# EAGLE schematic All Modules (EAGLE 9.5.1)
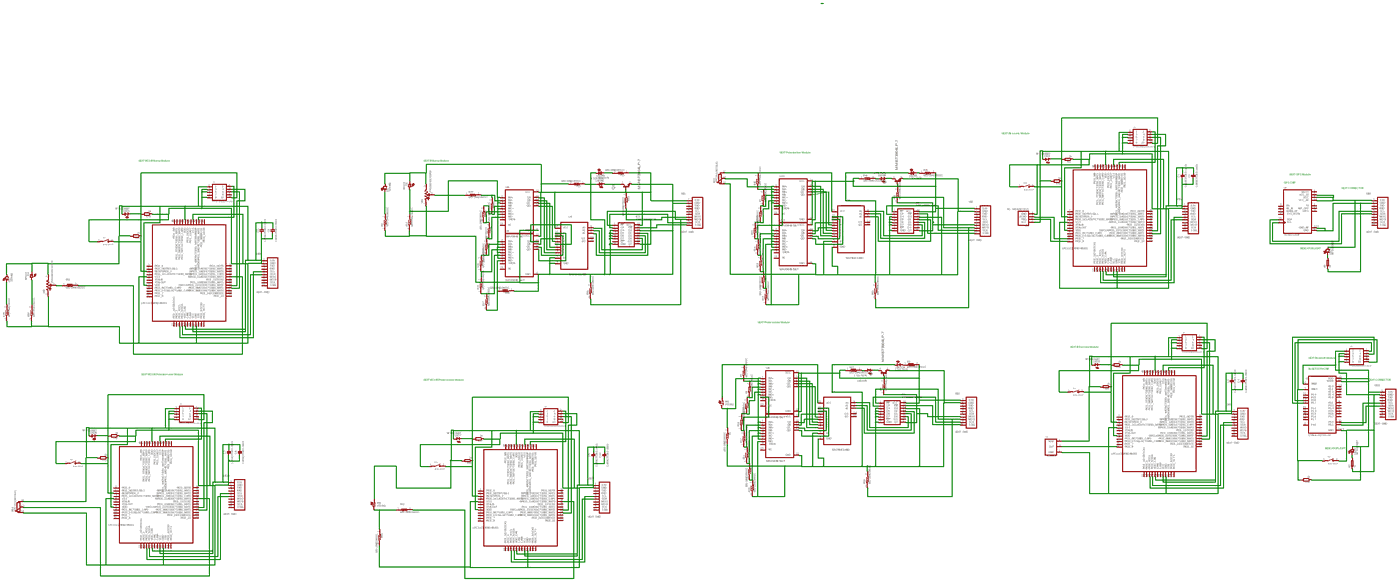
[diagram p0: schematic, sheet 1, overview]
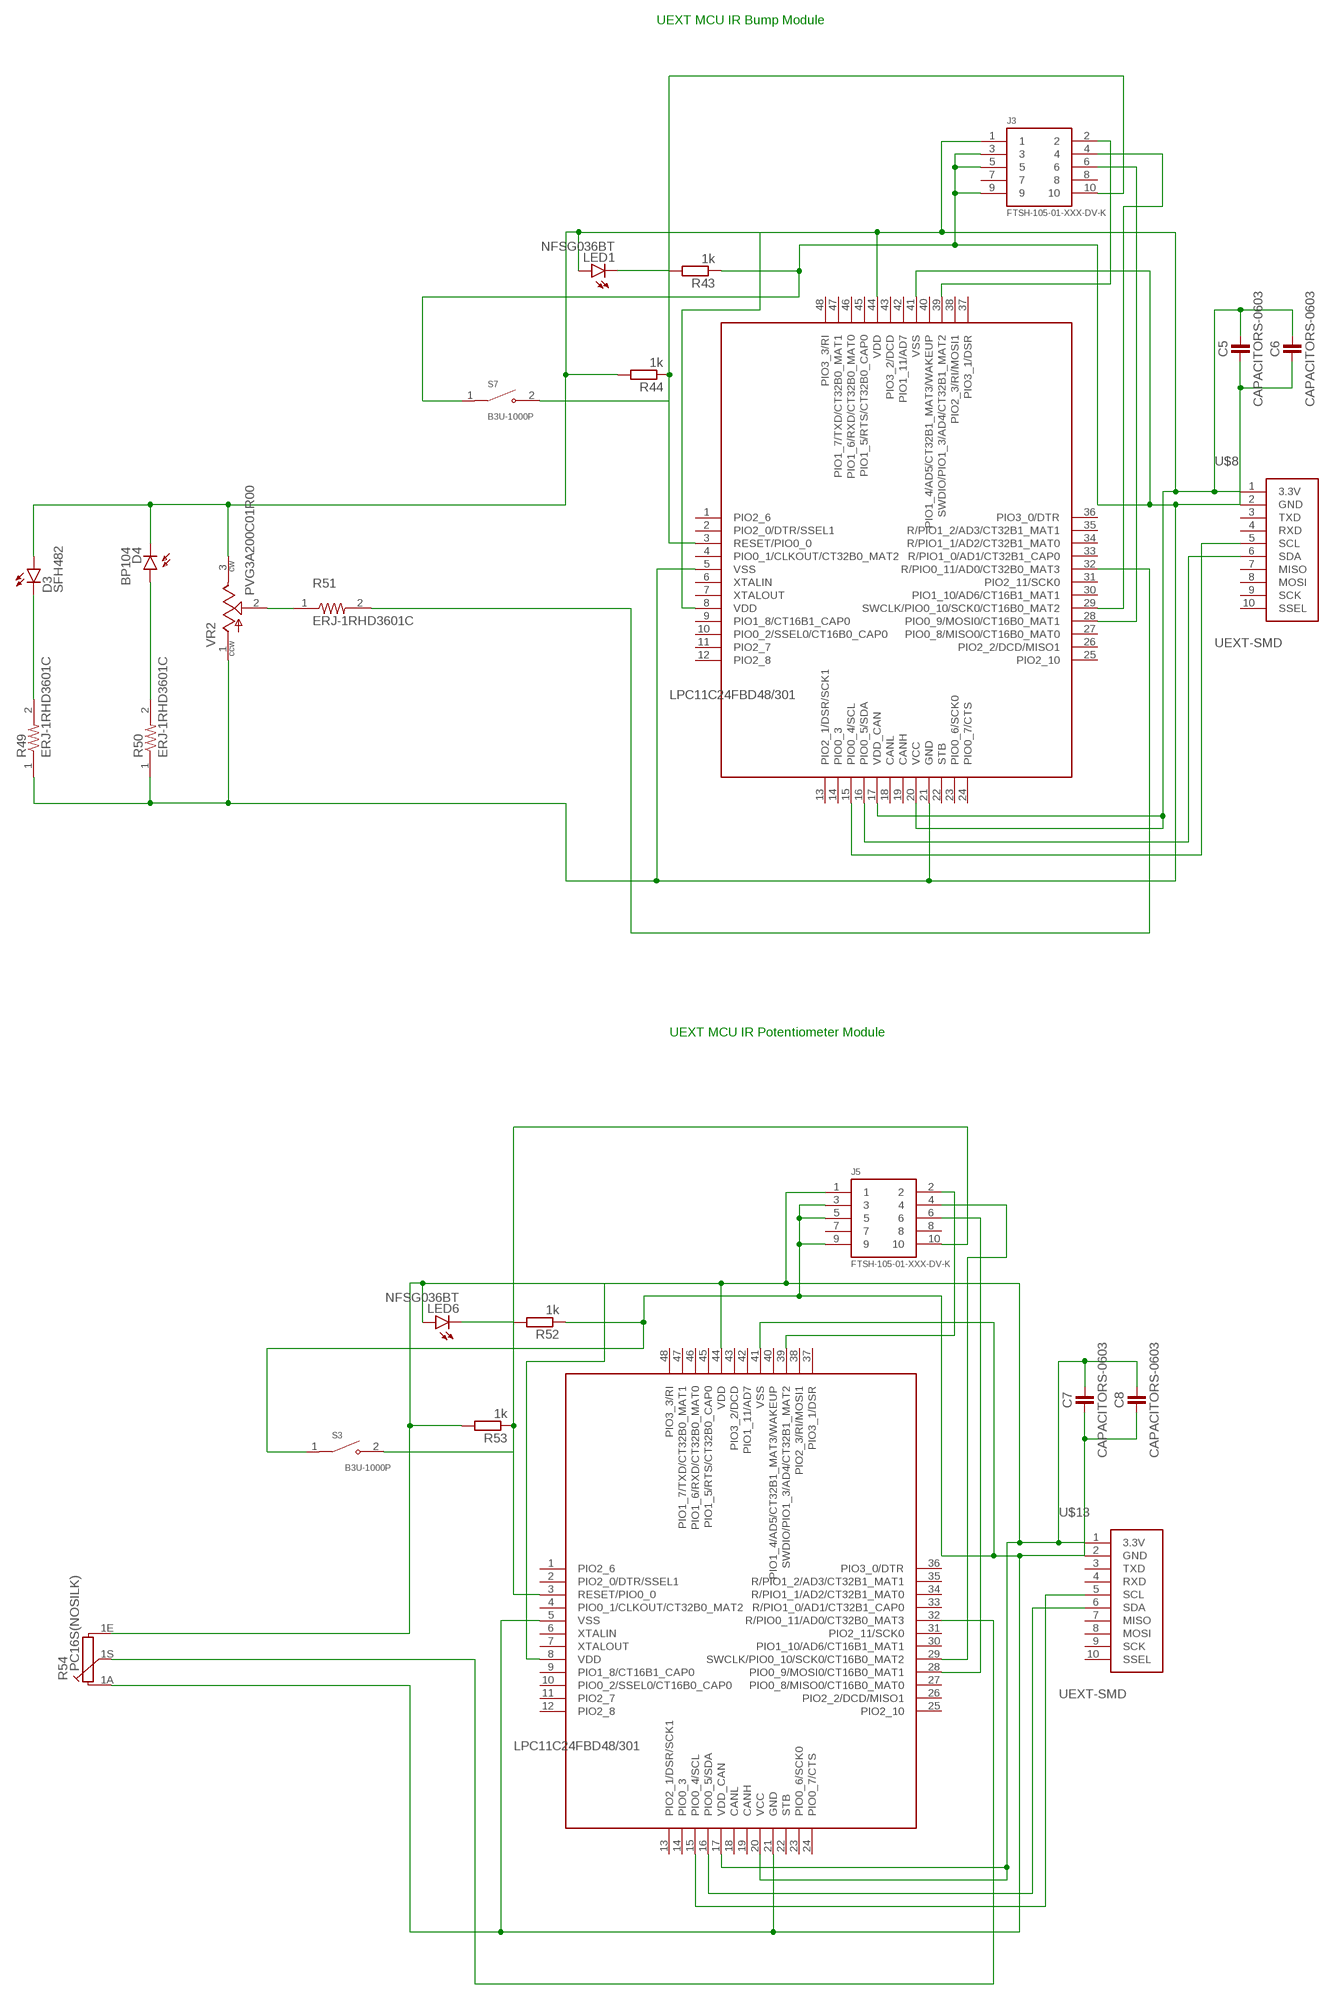
[diagram p1: schematic, sheet 1, part 1 of 4]
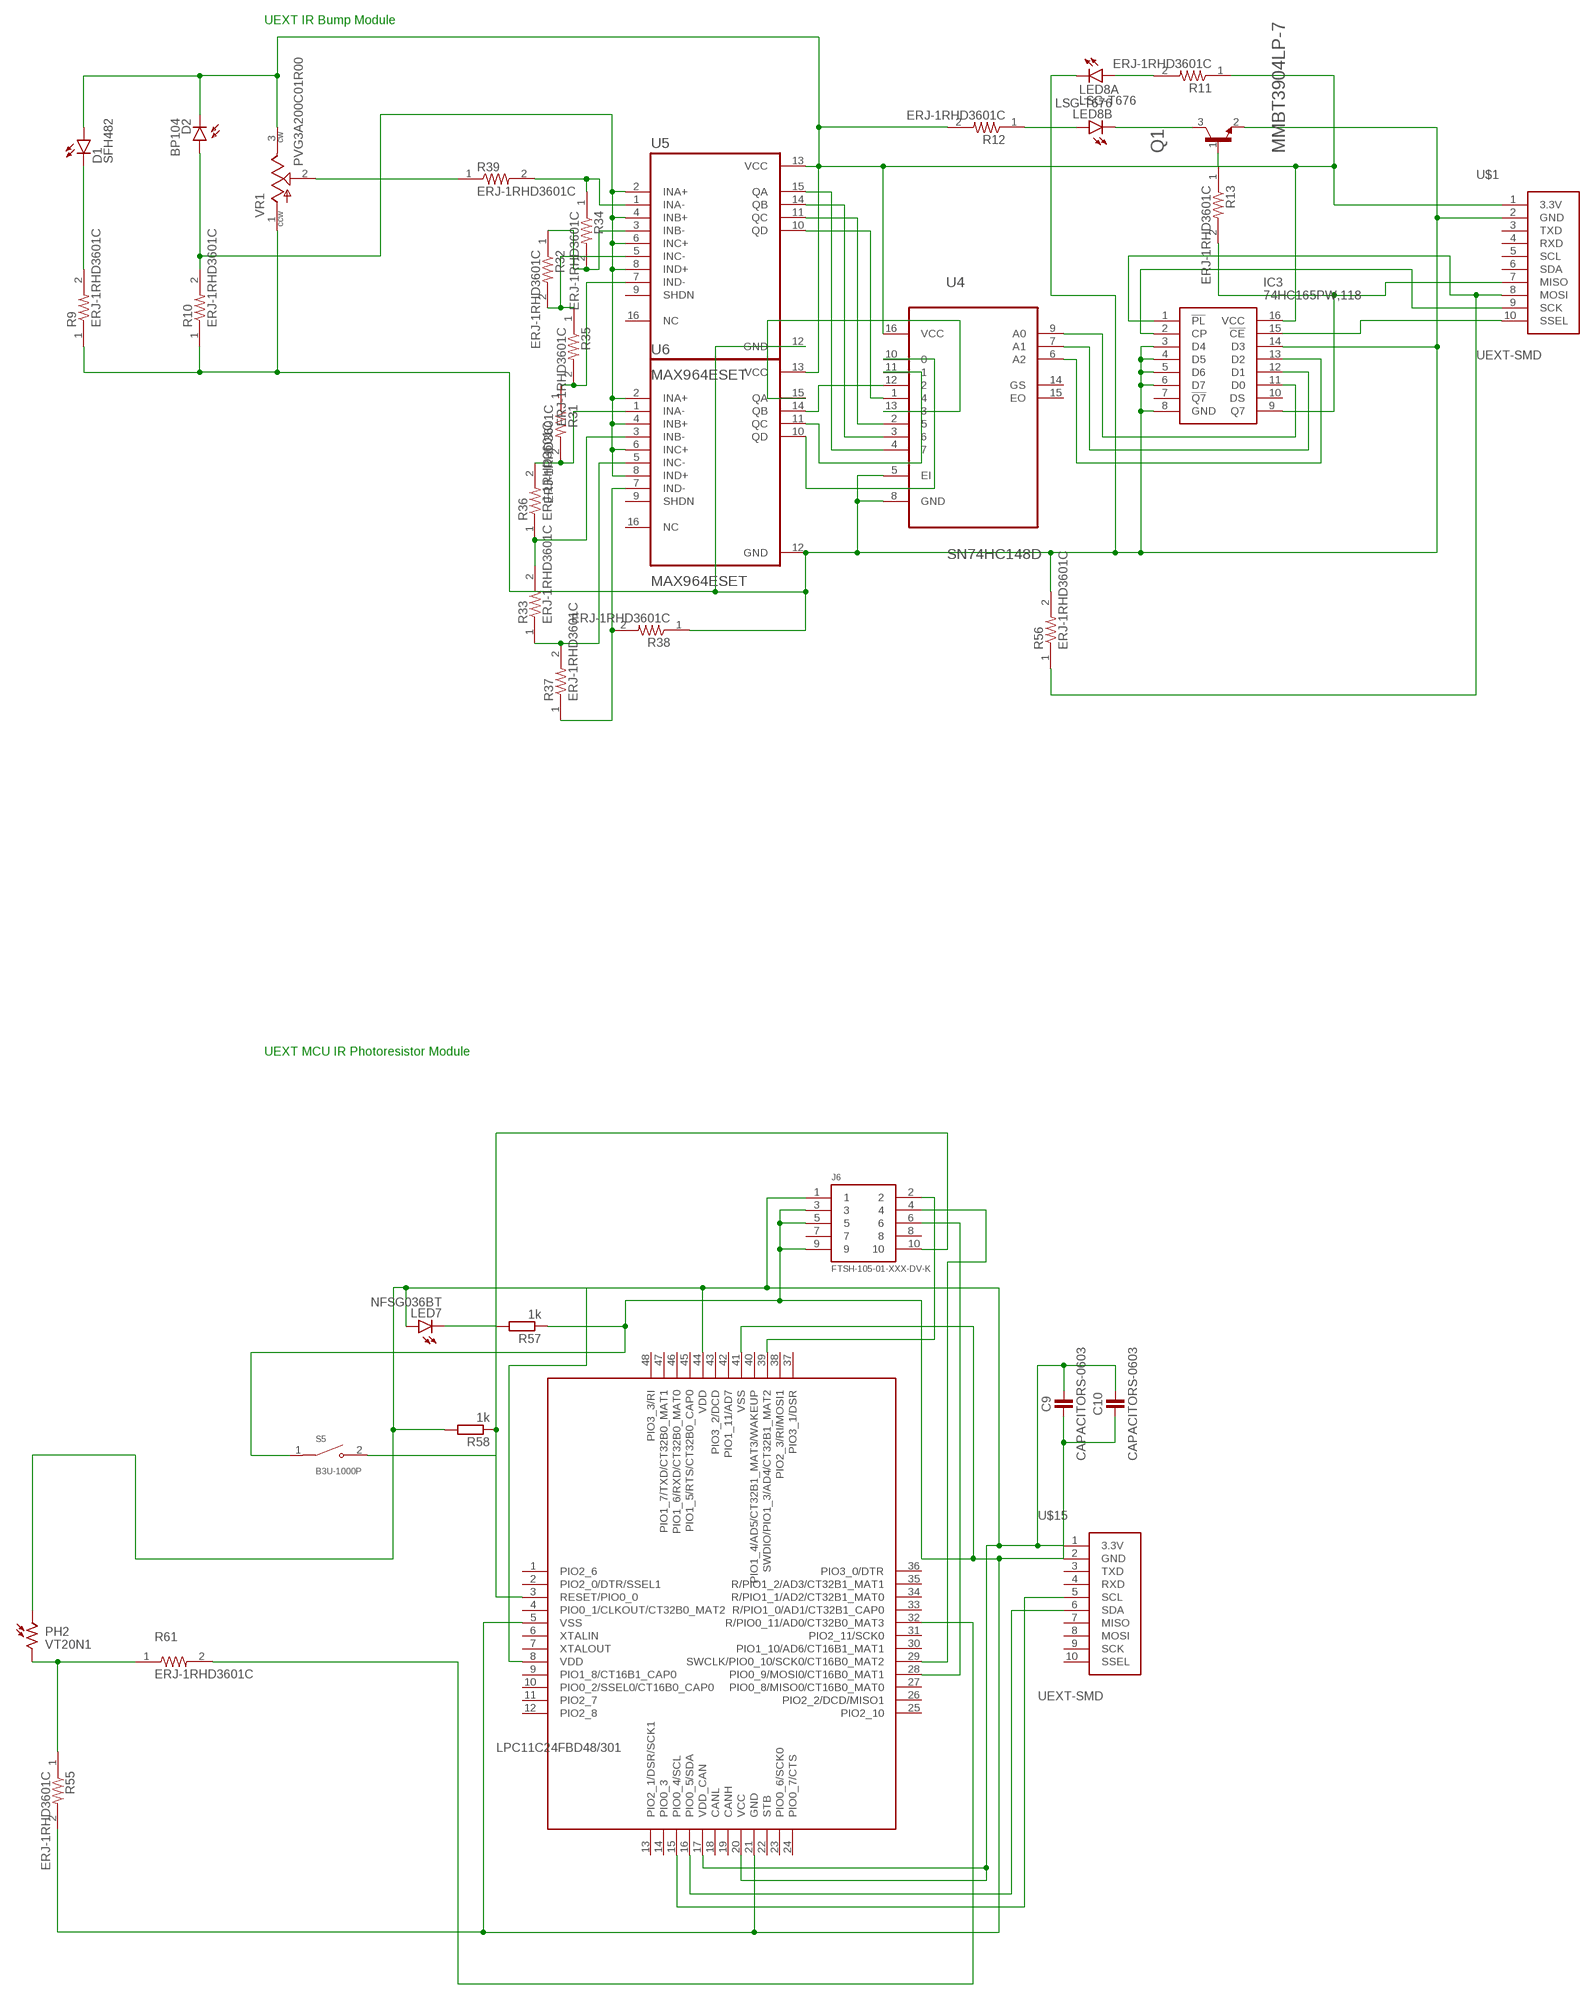
[diagram p2: schematic, sheet 1, part 2 of 4]
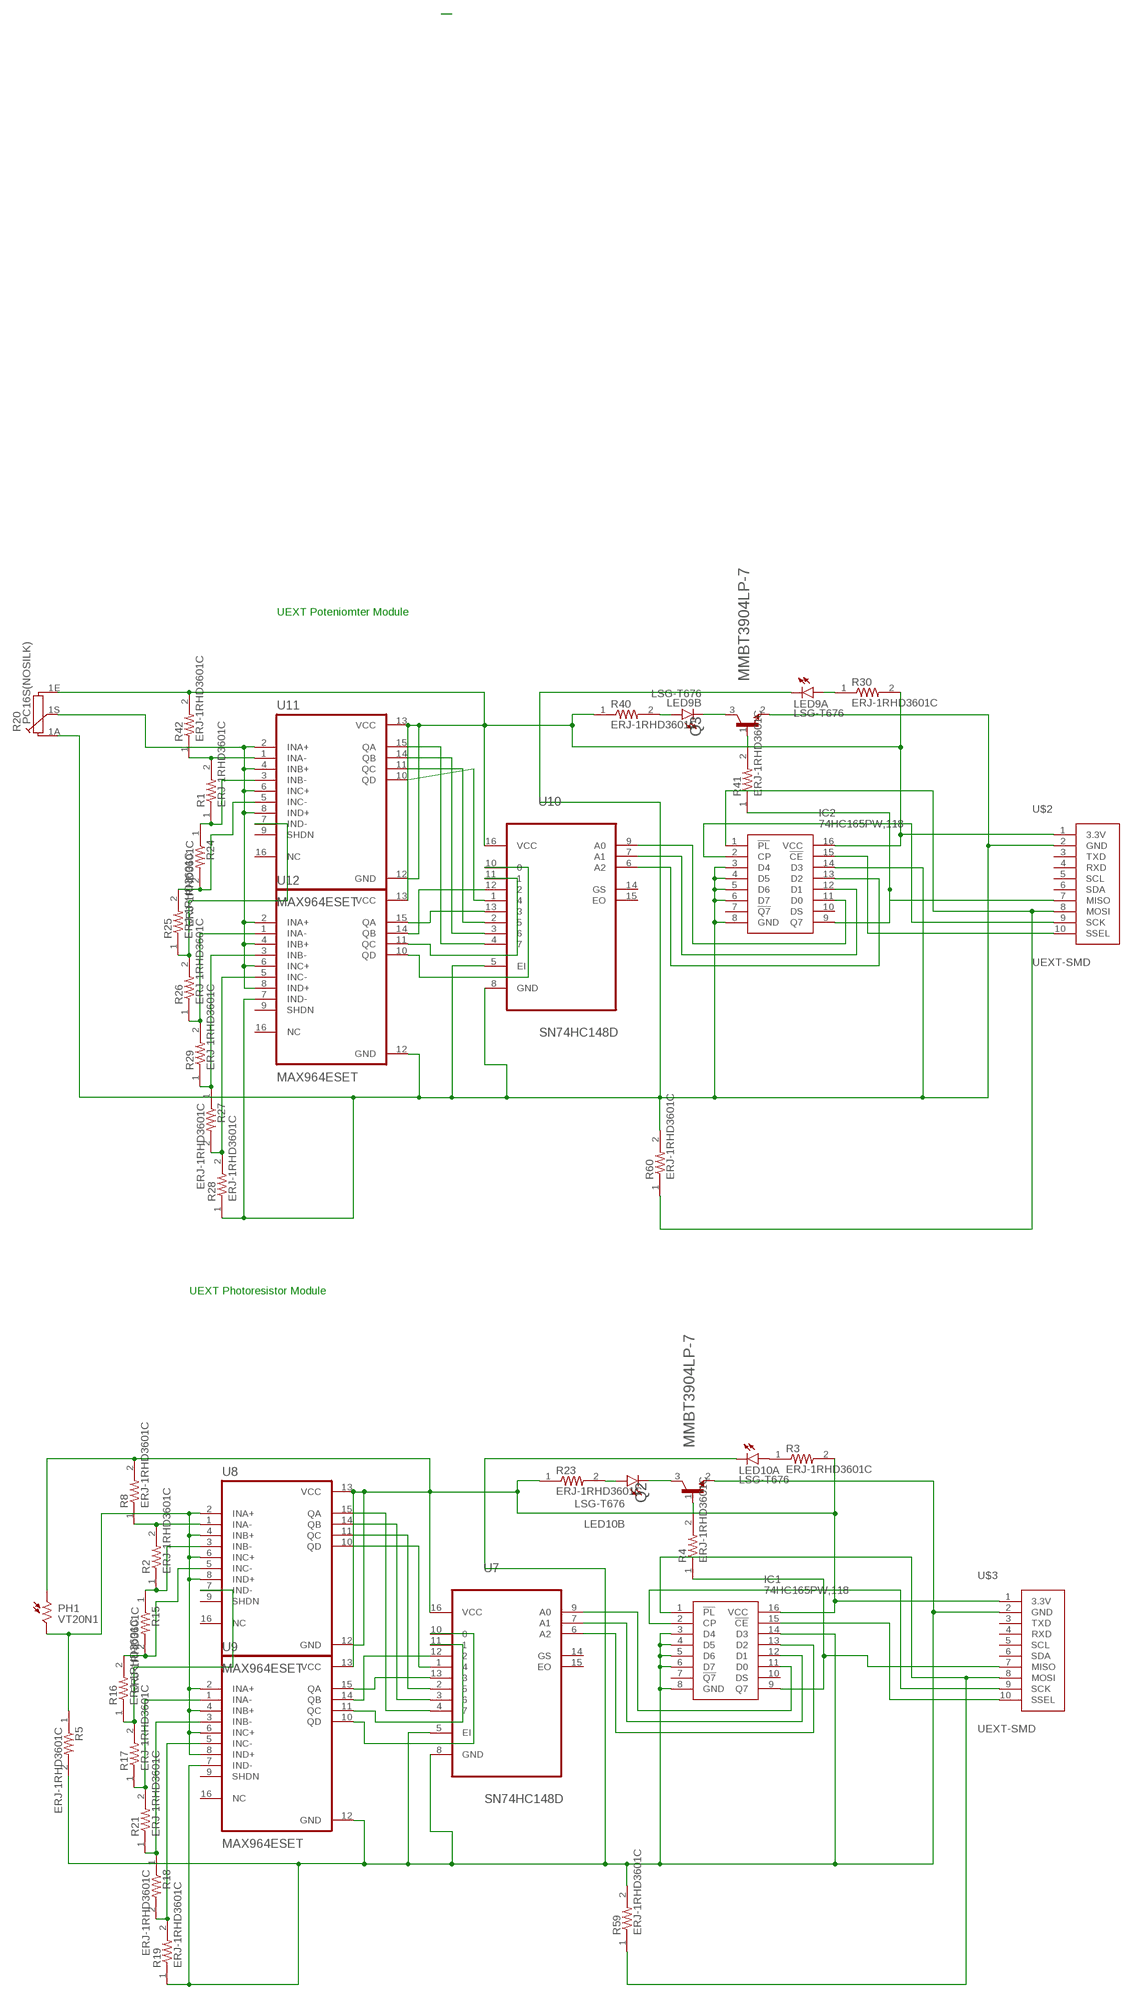
[diagram p3: schematic, sheet 1, part 3 of 4]
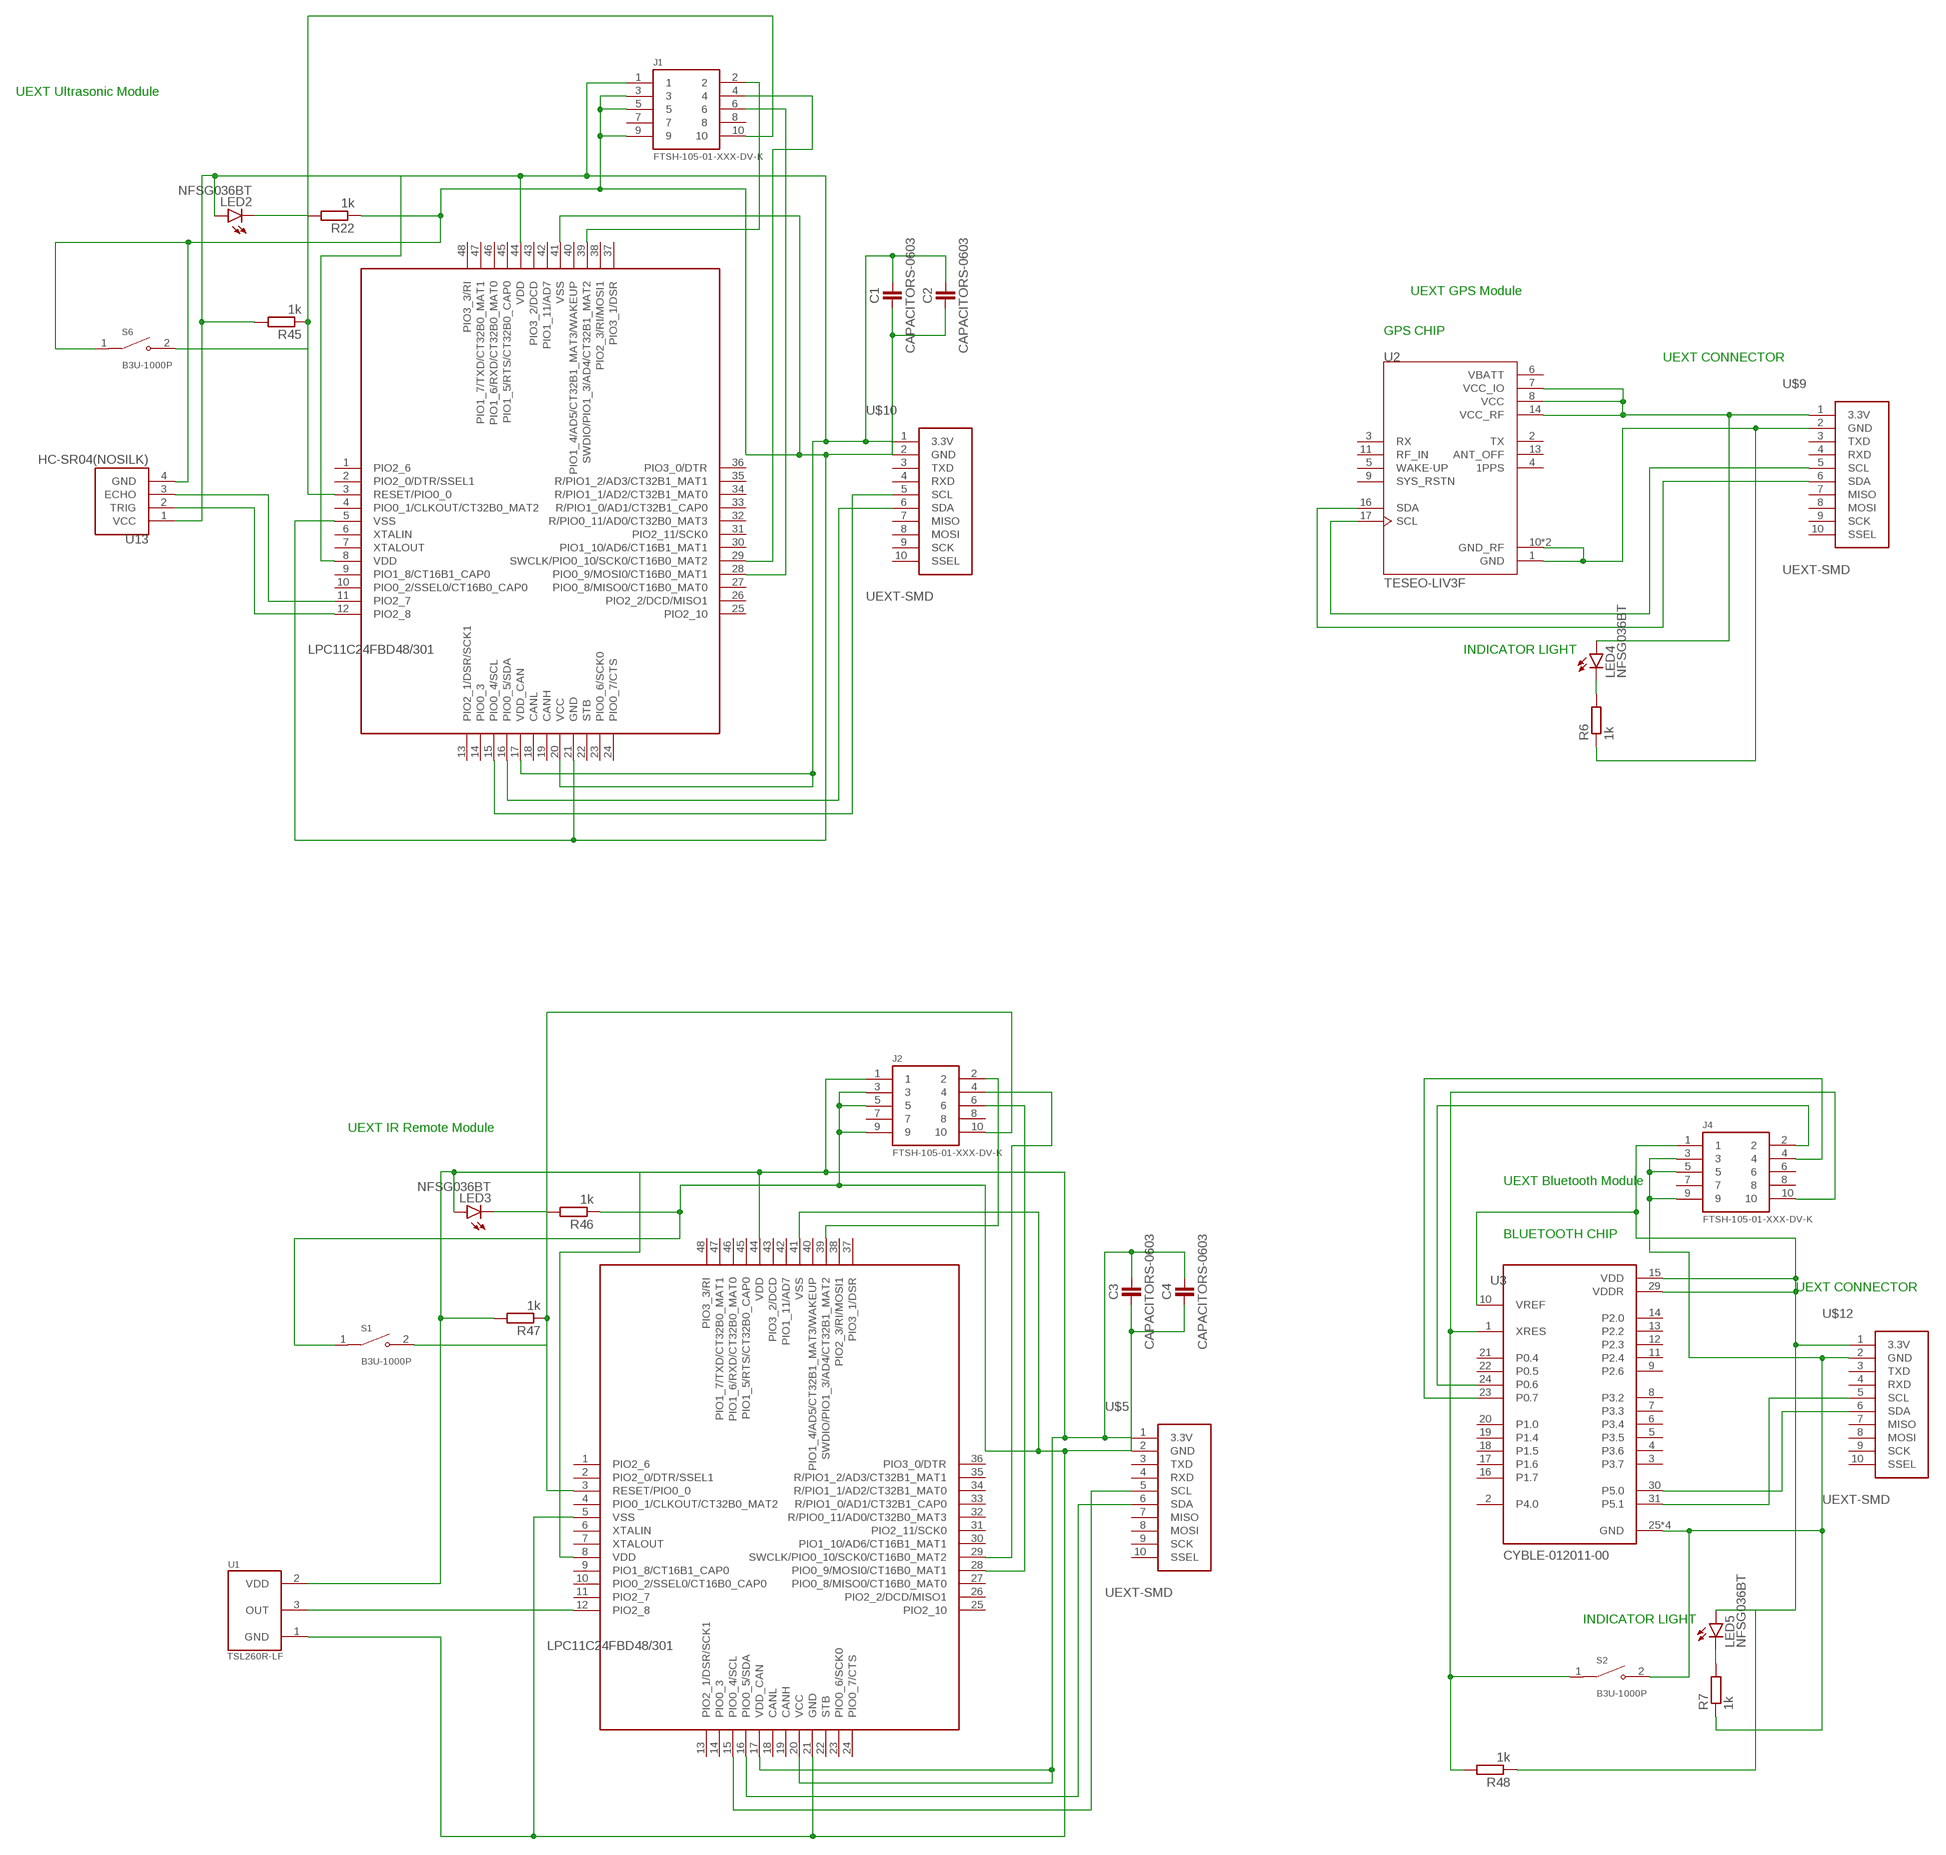
[diagram p4: schematic, sheet 1, part 4 of 4]

## Parts
C1  CAPACITORS-0603  [C0603]
C2  CAPACITORS-0603  [C0603]
C3  CAPACITORS-0603  [C0603]
C4  CAPACITORS-0603  [C0603]
C5  CAPACITORS-0603  [C0603]
C6  CAPACITORS-0603  [C0603]
C7  CAPACITORS-0603  [C0603]
C8  CAPACITORS-0603  [C0603]
C9  CAPACITORS-0603  [C0603]
C10  CAPACITORS-0603  [C0603]
D1  SFH482  [SFH482]
D2  BP104  [BP104]
D3  SFH482  [SFH482]
D4  BP104  [BP104]
IC1  74HC165PW,118  [SOP65P640X110-16N]
IC2  74HC165PW,118  [SOP65P640X110-16N]
IC3  74HC165PW,118  [SOP65P640X110-16N]
J1  FTSH-105-01-XXX-DV-K  [FTSH-105-01-XXX-DV-K]
J2  FTSH-105-01-XXX-DV-K  [FTSH-105-01-XXX-DV-K]
J3  FTSH-105-01-XXX-DV-K  [FTSH-105-01-XXX-DV-K]
J4  FTSH-105-01-XXX-DV-K  [FTSH-105-01-XXX-DV-K]
J5  FTSH-105-01-XXX-DV-K  [FTSH-105-01-XXX-DV-K]
J6  FTSH-105-01-XXX-DV-K  [FTSH-105-01-XXX-DV-K]
LED1  NFSG036BT  [NFSG036BT]
LED2  NFSG036BT  [NFSG036BT]
LED3  NFSG036BT  [NFSG036BT]
LED4  NFSG036BT  [NFSG036BT]
LED5  NFSG036BT  [NFSG036BT]
LED6  NFSG036BT  [NFSG036BT]
LED7  NFSG036BT  [NFSG036BT]
LED8  LSG-T676  [P-LCC4-0]
LED9  LSG-T676  [P-LCC4-0]
LED10  LSG-T676  [P-LCC4-0]
PH1  VT20N1  [TO46-VT200]
PH2  VT20N1  [TO46-VT200]
Q1  MMBT3904LP-7  [DFN101X61X53-3N]
Q2  MMBT3904LP-7  [DFN101X61X53-3N]
Q3  MMBT3904LP-7  [DFN101X61X53-3N]
R1  ERJ-1RHD3601C  [RESC0603X26N]
R2  ERJ-1RHD3601C  [RESC0603X26N]
R3  ERJ-1RHD3601C  [RESC0603X26N]
R4  ERJ-1RHD3601C  [RESC0603X26N]
R5  ERJ-1RHD3601C  [RESC0603X26N]
R6  1k  R-EU_M1206  [M1206]
R7  1k  R-EU_M1206  [M1206]
R8  ERJ-1RHD3601C  [RESC0603X26N]
R9  ERJ-1RHD3601C  [RESC0603X26N]
R10  ERJ-1RHD3601C  [RESC0603X26N]
R11  ERJ-1RHD3601C  [RESC0603X26N]
R12  ERJ-1RHD3601C  [RESC0603X26N]
R13  ERJ-1RHD3601C  [RESC0603X26N]
R15  ERJ-1RHD3601C  [RESC0603X26N]
R16  ERJ-1RHD3601C  [RESC0603X26N]
R17  ERJ-1RHD3601C  [RESC0603X26N]
R18  ERJ-1RHD3601C  [RESC0603X26N]
R19  ERJ-1RHD3601C  [RESC0603X26N]
R20  PC16S(NOSILK)  [PC16S(NOSILK)]
R21  ERJ-1RHD3601C  [RESC0603X26N]
R22  1k  R-EU_M1206  [M1206]
R23  ERJ-1RHD3601C  [RESC0603X26N]
R24  ERJ-1RHD3601C  [RESC0603X26N]
R25  ERJ-1RHD3601C  [RESC0603X26N]
R26  ERJ-1RHD3601C  [RESC0603X26N]
R27  ERJ-1RHD3601C  [RESC0603X26N]
R28  ERJ-1RHD3601C  [RESC0603X26N]
R29  ERJ-1RHD3601C  [RESC0603X26N]
R30  ERJ-1RHD3601C  [RESC0603X26N]
R31  ERJ-1RHD3601C  [RESC0603X26N]
R32  ERJ-1RHD3601C  [RESC0603X26N]
R33  ERJ-1RHD3601C  [RESC0603X26N]
R34  ERJ-1RHD3601C  [RESC0603X26N]
R35  ERJ-1RHD3601C  [RESC0603X26N]
R36  ERJ-1RHD3601C  [RESC0603X26N]
R37  ERJ-1RHD3601C  [RESC0603X26N]
R38  ERJ-1RHD3601C  [RESC0603X26N]
R39  ERJ-1RHD3601C  [RESC0603X26N]
R40  ERJ-1RHD3601C  [RESC0603X26N]
R41  ERJ-1RHD3601C  [RESC0603X26N]
R42  ERJ-1RHD3601C  [RESC0603X26N]
R43  1k  R-EU_M1206  [M1206]
R44  1k  R-EU_M1206  [M1206]
R45  1k  R-EU_M1206  [M1206]
R46  1k  R-EU_M1206  [M1206]
R47  1k  R-EU_M1206  [M1206]
R48  1k  R-EU_M1206  [M1206]
R49  ERJ-1RHD3601C  [RESC0603X26N]
R50  ERJ-1RHD3601C  [RESC0603X26N]
R51  ERJ-1RHD3601C  [RESC0603X26N]
R52  1k  R-EU_M1206  [M1206]
R53  1k  R-EU_M1206  [M1206]
R54  PC16S(NOSILK)  [PC16S(NOSILK)]
R55  ERJ-1RHD3601C  [RESC0603X26N]
R56  ERJ-1RHD3601C  [RESC0603X26N]
R57  1k  R-EU_M1206  [M1206]
R58  1k  R-EU_M1206  [M1206]
R59  ERJ-1RHD3601C  [RESC0603X26N]
R60  ERJ-1RHD3601C  [RESC0603X26N]
R61  ERJ-1RHD3601C  [RESC0603X26N]
S1  B3U-1000P  [SW_B3U-1000P]
S2  B3U-1000P  [SW_B3U-1000P]
S3  B3U-1000P  [SW_B3U-1000P]
S5  B3U-1000P  [SW_B3U-1000P]
S6  B3U-1000P  [SW_B3U-1000P]
S7  B3U-1000P  [SW_B3U-1000P]
U1  TSL260R-LF  [XDCR_TSL260R-LF]
U2  TESEO-LIV3F  [TESEO-LIV3F]
U3  CYBLE-012011-00  [XCVR_CYBLE-012011-00]
U4  SN74HC148D  [SOIC127P600X175-16N]
U5  MAX964ESET  [SOIC127P600X175-16N]
U6  MAX964ESET  [SOIC127P600X175-16N]
U7  SN74HC148D  [SOIC127P600X175-16N]
U8  MAX964ESET  [SOIC127P600X175-16N]
U9  MAX964ESET  [SOIC127P600X175-16N]
U10  SN74HC148D  [SOIC127P600X175-16N]
U11  MAX964ESET  [SOIC127P600X175-16N]
U12  MAX964ESET  [SOIC127P600X175-16N]
U13  HC-SR04(NOSILK)  [XCVR_HC-SR04(NOSILK)]
U$1  UEXT-SMD  [UEXT-SMD]
U$2  UEXT-SMD  [UEXT-SMD]
U$3  UEXT-SMD  [UEXT-SMD]
U$4  LPC11C24FBD48/301  [QFP50P900X900X160-48N]
U$5  UEXT-SMD  [UEXT-SMD]
U$6  LPC11C24FBD48/301  [QFP50P900X900X160-48N]
U$7  LPC11C24FBD48/301  [QFP50P900X900X160-48N]
U$8  UEXT-SMD  [UEXT-SMD]
U$9  UEXT-SMD  [UEXT-SMD]
U$10  UEXT-SMD  [UEXT-SMD]
U$11  LPC11C24FBD48/301  [QFP50P900X900X160-48N]
U$12  UEXT-SMD  [UEXT-SMD]
U$13  UEXT-SMD  [UEXT-SMD]
U$14  LPC11C24FBD48/301  [QFP50P900X900X160-48N]
U$15  UEXT-SMD  [UEXT-SMD]
VR1  PVG3A200C01R00  [TRIM_PVG3A200C01R00]
VR2  PVG3A200C01R00  [TRIM_PVG3A200C01R00]

## Nets
N$1: C1.1 C2.1 J1.3 J1.5 J1.9 R22.1 S6.1 U13.4(GND) U$7.5(VSS) U$7.21(GND) U$7.41(VSS) U$10.2(GND)
N$2: D1.A D2.K(C) IC3.16(VCC) R11.1 R12.2 U4.16(VCC) U5.13(VCC) U6.13(VCC) U$1.1(3.3V) VR1.3(CW)
N$3: LED2.C R22.2
N$4: Q3.1(B) R41.2
N$5: LED9.2(A:A) R30.1
N$6: C3.1 C4.1 J2.3 J2.5 J2.9 R46.1 S1.1 U1.1(GND) U$4.5(VSS) U$4.21(GND) U$4.41(VSS) U$5.2(GND)
N$7: IC3.15(!CE) U$1.10(SSEL)
N$8: Q2.1(B) R4.2
N$9: LED10.2(A:A) R3.1
N$10: LED10.3(B:C) Q2.3(C)
N$11: IC1.13(D2) U7.6(A2)
N$12: PH1.2 R5.1 U8.2(INA+) U8.4(INB+) U8.6(INC+) U8.8(IND+) U9.2(INA+) U9.4(INB+) U9.6(INC+) U9.8(IND+)
N$13: IC1.15(!CE) U$3.10(SSEL)
N$14: IC3.2(CP) U$1.9(SCK)
N$15: LED9.3(B:C) Q3.3(C)
N$16: IC1.9(Q7) R4.1 U$3.7(MISO)
N$17: IC2.11(D0) U10.9(A0)
N$18: LED10.4(B:A) R23.2
N$19: IC1.11(D0) U7.9(A0)
N$20: IC1.12(D1) U7.7(A1)
N$21: R6.1 U2.1(GND) U2.10(GND_RF) U2.12(GND_RF) U$9.2(GND)
N$22: LED4.A U2.7(VCC_IO) U2.8(VCC) U2.14(VCC_RF) U$9.1(3.3V)
N$23: U2.17(SCL) U$9.5(SCL)
N$24: U2.16(SDA) U$9.6(SDA)
N$25: LED4.C R6.2
N$26: J4.1 LED5.A R48.1 U3.10(VREF) U3.15(VDD) U3.29(VDDR) U$12.1(3.3V)
N$27: U3.30(P5.0) U$12.6(SDA)
N$28: U3.31(P5.1) U$12.5(SCL)
N$29: J4.3 J4.5 J4.9 R7.1 S2.2 U3.25(GND) U3.26(GND) U3.27(GND) U3.28(GND) U$12.2(GND)
N$30: LED5.C R7.2
N$31: D1.K(C) R9.2
N$32: LED8.2(A:A) R11.2
N$33: R2.1 R15.1 U8.3(INB-)
N$34: R15.2 R16.2 U8.5(INC-)
N$35: R16.1 R17.2 U8.7(IND-)
N$36: R17.1 R21.2 U9.1(INA-)
N$37: R18.1 R21.1 U9.3(INB-)
N$38: R18.2 R19.2 U9.5(INC-)
N$39: IC1.3(D4) IC1.4(D5) IC1.5(D6) IC1.6(D7) IC1.8(GND) IC1.14(D3) LED10.1(A:C) Q2.2(E) R5.2 R19.1 R59.2 U7.5(EI) U7.8(GND) U9.7(IND-) U9.12(GND) U$3.2(GND)
N$40: U7.4 U8.15(QA)
N$41: U7.3 U8.14(QB)
N$42: U7.2 U8.11(QC)
N$43: U7.1 U8.10(QD)
N$44: U7.13 U9.15(QA)
N$45: U7.12 U9.14(QB)
N$46: LED8.4(B:A) R12.1
N$47: LED8.3(B:C) Q1.3(C)
N$48: U7.11 U9.11(QC)
N$49: U7.10 U9.10(QD)
N$50: R2.2 R8.1 U8.1(INA-)
N$51: IC1.16(VCC) PH1.1 R3.2 R8.2 R23.1 U7.16(VCC) U8.12(GND) U8.13(VCC) U9.13(VCC) U$3.1(3.3V)
N$52: IC1.2(CP) U$3.9(SCK)
N$53: IC2.12(D1) U10.7(A1)
N$54: IC2.13(D2) U10.6(A2)
N$55: IC3.3(D4) IC3.4(D5) IC3.5(D6) IC3.6(D7) IC3.8(GND) IC3.14(D3) LED8.1(A:C) Q1.2(E) R9.1 R10.1 R38.1 R56.2 U4.5(EI) U4.8(GND) U5.12(GND) U6.12(GND) U$1.2(GND) VR1.1(CCW)
N$56: IC2.9(Q7) R41.1 U$2.7(MISO)
N$57: LED9.4(B:A) R40.2
N$58: R1.1 R24.1 U11.3(INB-)
N$59: R24.2 R25.2 U11.5(INC-)
N$60: R25.1 R26.2 U11.7(IND-)
N$61: R26.1 R29.2 U12.1(INA-)
N$62: R27.1 R29.1 U12.3(INB-)
N$63: R27.2 R28.2 U12.5(INC-)
N$64: IC2.3(D4) IC2.4(D5) IC2.5(D6) IC2.6(D7) IC2.8(GND) IC2.14(D3) LED9.1(A:C) Q3.2(E) R20.1A R28.1 R60.2 U10.5(EI) U10.8(GND) U12.7(IND-) U12.12(GND) U$2.2(GND)
N$65: U10.4 U11.15(QA)
N$66: U10.3 U11.14(QB)
N$67: U10.2 U11.11(QC)
N$68: U10.1 U11.10(QD)
N$69: U10.13 U12.15(QA)
N$71: D2.A R10.2 U5.2(INA+) U5.4(INB+) U5.6(INC+) U5.8(IND+) U6.2(INA+) U6.4(INB+) U6.6(INC+) U6.8(IND+)
N$72: Q1.1(B) R13.1
N$73: U10.12 U12.14(QB)
N$74: IC3.11(D0) U4.9(A0)
N$75: IC3.12(D1) U4.7(A1)
N$76: IC3.13(D2) U4.6(A2)
N$77: IC3.9(Q7) R13.2 U$1.7(MISO)
N$78: U10.11 U12.11(QC)
N$80: R34.1 R39.2 U5.1(INA-)
N$81: U$7.16(PIO0_5/SDA) U$10.6(SDA)
N$82: U$7.15(PIO0_4/SCL) U$10.5(SCL)
N$83: R32.1 R34.2 U5.3(INB-)
N$84: J1.4 U$7.29(SWCLK/PIO0_10/SCK0/CT16B0_MAT2)
N$85: J1.2 U$7.39(SWDIO/PIO1_3/AD4/CT32B1_MAT2)
N$86: J1.6 U$7.28(PIO0_9/MOSI0/CT16B0_MAT1)
N$87: U13.2(TRIG) U$7.12(PIO2_8)
N$88: U13.3(ECHO) U$7.11(PIO2_7)
N$89: R32.2 R35.1 U5.5(INC-)
N$91: R31.1 R35.2 U5.7(IND-)
N$92: R31.2 R36.2 U6.1(INA-)
N$93: R33.2 R36.1 U6.3(INB-)
N$94: R33.1 R37.2 U6.5(INC-)
N$95: R37.1 R38.2 U6.7(IND-)
N$96: U4.4 U5.15(QA)
N$97: U4.3 U5.14(QB)
N$98: U4.2 U5.11(QC)
N$99: U4.1 U5.10(QD)
N$100: U4.13 U6.15(QA)
N$101: U4.12 U6.14(QB)
N$102: U4.11 U6.11(QC)
N$103: U4.10 U6.10(QD)
N$104: U10.10 U12.10(QD)
N$105: R1.2 R42.1 U11.1(INA-)
N$106: IC2.15(!CE) U$2.10(SSEL)
N$107: IC2.2(CP) U$2.9(SCK)
N$108: IC2.16(VCC) R20.1E R30.2 R40.1 R42.2 U10.16(VCC) U11.12(GND) U11.13(VCC) U12.13(VCC) U$2.1(3.3V)
N$109: R20.1S U11.2(INA+) U11.4(INB+) U11.6(INC+) U11.8(IND+) U12.2(INA+) U12.4(INB+) U12.6(INC+) U12.8(IND+)
N$110: LED6.C R52.2
N$111: LED1.C R43.2
N$112: J1.10 R45.1 S6.2 U$7.3(RESET/PIO0_0)
N$113: C1.2 C2.2 J1.1 LED2.A R45.2 U13.1(VCC) U$7.8(VDD) U$7.17(VDD_CAN) U$7.20(VCC) U$7.44(VDD) U$10.1(3.3V)
N$114: J4.10 R48.2 S2.1 U3.1(XRES)
N$115: LED3.C R46.2
N$116: U$11.16(PIO0_5/SDA) U$13.6(SDA)
N$117: U$4.16(PIO0_5/SDA) U$5.6(SDA)
N$118: U$4.15(PIO0_4/SCL) U$5.5(SCL)
N$119: C3.2 C4.2 J2.1 LED3.A R47.2 U1.2(VDD) U$4.8(VDD) U$4.17(VDD_CAN) U$4.20(VCC) U$4.44(VDD) U$5.1(3.3V)
N$120: J2.4 U$4.29(SWCLK/PIO0_10/SCK0/CT16B0_MAT2)
N$121: U$6.16(PIO0_5/SDA) U$8.6(SDA)
N$122: J2.2 U$4.39(SWDIO/PIO1_3/AD4/CT32B1_MAT2)
N$123: J2.6 U$4.28(PIO0_9/MOSI0/CT16B0_MAT1)
N$124: U$6.15(PIO0_4/SCL) U$8.5(SCL)
N$125: U1.3(OUT) U$4.12(PIO2_8)
N$126: J4.2 U3.24(P0.6)
N$127: J2.10 R47.1 S1.2 U$4.3(RESET/PIO0_0)
N$128: J4.4 U3.23(P0.7)
N$129: J3.4 U$6.29(SWCLK/PIO0_10/SCK0/CT16B0_MAT2)
N$130: J3.2 U$6.39(SWDIO/PIO1_3/AD4/CT32B1_MAT2)
N$131: J3.6 U$6.28(PIO0_9/MOSI0/CT16B0_MAT1)
N$132: D3.K(C) R49.2
N$133: D4.A R50.2
N$134: R51.1 VR2.2(WIPER)
N$135: J3.10 R44.1 S7.2 U$6.3(RESET/PIO0_0)
N$136: R51.2 U$6.32(R/PIO0_11/AD0/CT32B0_MAT3)
N$137: C5.1 C6.1 J3.3 J3.5 J3.9 R43.1 R49.1 R50.1 S7.1 U$6.5(VSS) U$6.21(GND) U$6.41(VSS) U$8.2(GND) VR2.1(CCW)
N$138: C5.2 C6.2 D3.A D4.K(C) J3.1 LED1.A R44.2 U$6.8(VDD) U$6.17(VDD_CAN) U$6.20(VCC) U$6.44(VDD) U$8.1(3.3V) VR2.3(CW)
N$139: U$11.15(PIO0_4/SCL) U$13.5(SCL)
N$140: J5.4 U$11.29(SWCLK/PIO0_10/SCK0/CT16B0_MAT2)
N$141: J5.2 U$11.39(SWDIO/PIO1_3/AD4/CT32B1_MAT2)
N$142: J5.6 U$11.28(PIO0_9/MOSI0/CT16B0_MAT1)
N$143: J5.10 R53.1 S3.2 U$11.3(RESET/PIO0_0)
N$144: C7.1 C8.1 J5.3 J5.5 J5.9 R52.1 R54.1A S3.1 U$11.5(VSS) U$11.21(GND) U$11.41(VSS) U$13.2(GND)
N$145: R39.1 VR1.2(WIPER)
N$146: R54.1S
N$147: U$11.32(R/PIO0_11/AD0/CT32B0_MAT3)
N$148: C9.2 C10.2 J6.1 LED7.A PH2.1 R58.2 U$14.8(VDD) U$14.17(VDD_CAN) U$14.20(VCC) U$14.44(VDD) U$15.1(3.3V)
N$149: C7.2 C8.2 J5.1 LED6.A R53.2 R54.1E U$11.8(VDD) U$11.17(VDD_CAN) U$11.20(VCC) U$11.44(VDD) U$13.1(3.3V)
N$150: LED7.C R57.2
N$151: U$14.16(PIO0_5/SDA) U$15.6(SDA)
N$152: U$14.15(PIO0_4/SCL) U$15.5(SCL)
N$153: J6.4 U$14.29(SWCLK/PIO0_10/SCK0/CT16B0_MAT2)
N$154: J6.2 U$14.39(SWDIO/PIO1_3/AD4/CT32B1_MAT2)
N$155: J6.6 U$14.28(PIO0_9/MOSI0/CT16B0_MAT1)
N$156: J6.10 R58.1 S5.2 U$14.3(RESET/PIO0_0)
N$157: PH2.2 R55.1 R61.1
N$158: IC3.1(!PL) R56.1 U$1.8(MOSI)
N$160: R61.2 U$14.32(R/PIO0_11/AD0/CT32B0_MAT3)
N$161: C9.1 C10.1 J6.3 J6.5 J6.9 R55.2 R57.1 S5.1 U$14.5(VSS) U$14.21(GND) U$14.41(VSS) U$15.2(GND)
N$162: IC1.1(!PL) R59.1 U$3.8(MOSI)
N$164: IC2.1(!PL) R60.1 U$2.8(MOSI)
Unconnected: IC1.7(!Q7) IC1.10(DS) IC2.7(!Q7) IC2.10(DS) IC3.7(!Q7) IC3.10(DS) J1.7 J1.8 J2.7 J2.8 J3.7 J3.8 J4.6 J4.7 J4.8 J5.7 J5.8 J6.7 J6.8 U2.2(TX) U2.3(RX) U2.4(1PPS) U2.5(WAKE-UP) U2.9(SYS_RSTN) U2.11(RF_IN) U2.13(ANT_OFF) U3.2(P4.0) U3.3(P3.7) U3.4(P3.6) U3.5(P3.5) U3.6(P3.4) U3.7(P3.3) U3.8(P3.2) U3.9(P2.6) U3.11(P2.4) U3.12(P2.3) U3.13(P2.2) U3.14(P2.0) U3.16(P1.7) U3.17(P1.6) U3.18(P1.5) U3.19(P1.4) U3.20(P1.0) U3.21(P0.4) U3.22(P0.5) U4.14(GS) U4.15(EO) U5.9(SHDN) U5.16(NC) U6.9(SHDN) U6.16(NC) U7.14(GS) U7.15(EO) U8.9(SHDN) U8.16(NC) U9.9(SHDN) U9.16(NC) U10.14(GS) U10.15(EO) U11.9(SHDN) U11.16(NC) U12.9(SHDN) U12.16(NC) U$1.3(TXD) U$1.4(RXD) U$1.5(SCL) U$1.6(SDA) U$2.3(TXD) U$2.4(RXD) U$2.5(SCL) U$2.6(SDA) U$3.3(TXD) U$3.4(RXD) U$3.5(SCL) U$3.6(SDA) U$4.1(PIO2_6) U$4.2(PIO2_0/DTR/SSEL1) U$4.4(PIO0_1/CLKOUT/CT32B0_MAT2) U$4.6(XTALIN) U$4.7(XTALOUT) U$4.9(PIO1_8/CT16B1_CAP0) U$4.10(PIO0_2/SSEL0/CT16B0_CAP0) U$4.11(PIO2_7) U$4.13(PIO2_1/DSR/SCK1) U$4.14(PIO0_3) U$4.18(CANL) U$4.19(CANH) U$4.22(STB) U$4.23(PIO0_6/SCK0) U$4.24(PIO0_7/CTS) U$4.25(PIO2_10) U$4.26(PIO2_2/DCD/MISO1) U$4.27(PIO0_8/MISO0/CT16B0_MAT0) U$4.30(PIO1_10/AD6/CT16B1_MAT1) U$4.31(PIO2_11/SCK0) U$4.32(R/PIO0_11/AD0/CT32B0_MAT3) U$4.33(R/PIO1_0/AD1/CT32B1_CAP0) U$4.34(R/PIO1_1/AD2/CT32B1_MAT0) U$4.35(R/PIO1_2/AD3/CT32B1_MAT1) U$4.36(PIO3_0/DTR) U$4.37(PIO3_1/DSR) U$4.38(PIO2_3/RI/MOSI1) U$4.40(PIO1_4/AD5/CT32B1_MAT3/WAKEUP) U$4.42(PIO1_11/AD7) U$4.43(PIO3_2/DCD) U$4.45(PIO1_5/RTS/CT32B0_CAP0) U$4.46(PIO1_6/RXD/CT32B0_MAT0) U$4.47(PIO1_7/TXD/CT32B0_MAT1) U$4.48(PIO3_3/RI) U$5.3(TXD) U$5.4(RXD) U$5.7(MISO) U$5.8(MOSI) U$5.9(SCK) U$5.10(SSEL) U$6.1(PIO2_6) U$6.2(PIO2_0/DTR/SSEL1) U$6.4(PIO0_1/CLKOUT/CT32B0_MAT2) U$6.6(XTALIN) U$6.7(XTALOUT) U$6.9(PIO1_8/CT16B1_CAP0) U$6.10(PIO0_2/SSEL0/CT16B0_CAP0) U$6.11(PIO2_7) U$6.12(PIO2_8) U$6.13(PIO2_1/DSR/SCK1) U$6.14(PIO0_3) U$6.18(CANL) U$6.19(CANH) U$6.22(STB) U$6.23(PIO0_6/SCK0) U$6.24(PIO0_7/CTS) U$6.25(PIO2_10) U$6.26(PIO2_2/DCD/MISO1) U$6.27(PIO0_8/MISO0/CT16B0_MAT0) U$6.30(PIO1_10/AD6/CT16B1_MAT1) U$6.31(PIO2_11/SCK0) U$6.33(R/PIO1_0/AD1/CT32B1_CAP0) U$6.34(R/PIO1_1/AD2/CT32B1_MAT0) U$6.35(R/PIO1_2/AD3/CT32B1_MAT1) U$6.36(PIO3_0/DTR) U$6.37(PIO3_1/DSR) U$6.38(PIO2_3/RI/MOSI1) U$6.40(PIO1_4/AD5/CT32B1_MAT3/WAKEUP) U$6.42(PIO1_11/AD7) U$6.43(PIO3_2/DCD) U$6.45(PIO1_5/RTS/CT32B0_CAP0) U$6.46(PIO1_6/RXD/CT32B0_MAT0) U$6.47(PIO1_7/TXD/CT32B0_MAT1) U$6.48(PIO3_3/RI) U$7.1(PIO2_6) U$7.2(PIO2_0/DTR/SSEL1) U$7.4(PIO0_1/CLKOUT/CT32B0_MAT2) U$7.6(XTALIN) U$7.7(XTALOUT) U$7.9(PIO1_8/CT16B1_CAP0) U$7.10(PIO0_2/SSEL0/CT16B0_CAP0) U$7.13(PIO2_1/DSR/SCK1) U$7.14(PIO0_3) U$7.18(CANL) U$7.19(CANH) U$7.22(STB) U$7.23(PIO0_6/SCK0) U$7.24(PIO0_7/CTS) U$7.25(PIO2_10) U$7.26(PIO2_2/DCD/MISO1) U$7.27(PIO0_8/MISO0/CT16B0_MAT0) U$7.30(PIO1_10/AD6/CT16B1_MAT1) U$7.31(PIO2_11/SCK0) U$7.32(R/PIO0_11/AD0/CT32B0_MAT3) U$7.33(R/PIO1_0/AD1/CT32B1_CAP0) U$7.34(R/PIO1_1/AD2/CT32B1_MAT0) U$7.35(R/PIO1_2/AD3/CT32B1_MAT1) U$7.36(PIO3_0/DTR) U$7.37(PIO3_1/DSR) U$7.38(PIO2_3/RI/MOSI1) U$7.40(PIO1_4/AD5/CT32B1_MAT3/WAKEUP) U$7.42(PIO1_11/AD7) U$7.43(PIO3_2/DCD) U$7.45(PIO1_5/RTS/CT32B0_CAP0) U$7.46(PIO1_6/RXD/CT32B0_MAT0) U$7.47(PIO1_7/TXD/CT32B0_MAT1) U$7.48(PIO3_3/RI) U$8.3(TXD) U$8.4(RXD) U$8.7(MISO) U$8.8(MOSI) U$8.9(SCK) U$8.10(SSEL) U$9.3(TXD) U$9.4(RXD) U$9.7(MISO) U$9.8(MOSI) U$9.9(SCK) U$9.10(SSEL) U$10.3(TXD) U$10.4(RXD) U$10.7(MISO) U$10.8(MOSI) U$10.9(SCK) U$10.10(SSEL) U$11.1(PIO2_6) U$11.2(PIO2_0/DTR/SSEL1) U$11.4(PIO0_1/CLKOUT/CT32B0_MAT2) U$11.6(XTALIN) U$11.7(XTALOUT) U$11.9(PIO1_8/CT16B1_CAP0) U$11.10(PIO0_2/SSEL0/CT16B0_CAP0) U$11.11(PIO2_7) U$11.12(PIO2_8) U$11.13(PIO2_1/DSR/SCK1) U$11.14(PIO0_3) U$11.18(CANL) U$11.19(CANH) U$11.22(STB) U$11.23(PIO0_6/SCK0) U$11.24(PIO0_7/CTS) U$11.25(PIO2_10) U$11.26(PIO2_2/DCD/MISO1) U$11.27(PIO0_8/MISO0/CT16B0_MAT0) U$11.30(PIO1_10/AD6/CT16B1_MAT1) U$11.31(PIO2_11/SCK0) U$11.33(R/PIO1_0/AD1/CT32B1_CAP0) U$11.34(R/PIO1_1/AD2/CT32B1_MAT0) U$11.35(R/PIO1_2/AD3/CT32B1_MAT1) U$11.36(PIO3_0/DTR) U$11.37(PIO3_1/DSR) U$11.38(PIO2_3/RI/MOSI1) U$11.40(PIO1_4/AD5/CT32B1_MAT3/WAKEUP) U$11.42(PIO1_11/AD7) U$11.43(PIO3_2/DCD) U$11.45(PIO1_5/RTS/CT32B0_CAP0) U$11.46(PIO1_6/RXD/CT32B0_MAT0) U$11.47(PIO1_7/TXD/CT32B0_MAT1) U$11.48(PIO3_3/RI) U$12.3(TXD) U$12.4(RXD) U$12.7(MISO) U$12.8(MOSI) U$12.9(SCK) U$12.10(SSEL) U$13.3(TXD) U$13.4(RXD) U$13.7(MISO) U$13.8(MOSI) U$13.9(SCK) U$13.10(SSEL) U$14.1(PIO2_6) U$14.2(PIO2_0/DTR/SSEL1) U$14.4(PIO0_1/CLKOUT/CT32B0_MAT2) U$14.6(XTALIN) U$14.7(XTALOUT) U$14.9(PIO1_8/CT16B1_CAP0) U$14.10(PIO0_2/SSEL0/CT16B0_CAP0) U$14.11(PIO2_7) U$14.12(PIO2_8) U$14.13(PIO2_1/DSR/SCK1) U$14.14(PIO0_3) U$14.18(CANL) U$14.19(CANH) U$14.22(STB) U$14.23(PIO0_6/SCK0) U$14.24(PIO0_7/CTS) U$14.25(PIO2_10) U$14.26(PIO2_2/DCD/MISO1) U$14.27(PIO0_8/MISO0/CT16B0_MAT0) U$14.30(PIO1_10/AD6/CT16B1_MAT1) U$14.31(PIO2_11/SCK0) U$14.33(R/PIO1_0/AD1/CT32B1_CAP0) U$14.34(R/PIO1_1/AD2/CT32B1_MAT0) U$14.35(R/PIO1_2/AD3/CT32B1_MAT1) U$14.36(PIO3_0/DTR) U$14.37(PIO3_1/DSR) U$14.38(PIO2_3/RI/MOSI1) U$14.40(PIO1_4/AD5/CT32B1_MAT3/WAKEUP) U$14.42(PIO1_11/AD7) U$14.43(PIO3_2/DCD) U$14.45(PIO1_5/RTS/CT32B0_CAP0) U$14.46(PIO1_6/RXD/CT32B0_MAT0) U$14.47(PIO1_7/TXD/CT32B0_MAT1) U$14.48(PIO3_3/RI) U$15.3(TXD) U$15.4(RXD) U$15.7(MISO) U$15.8(MOSI) U$15.9(SCK) U$15.10(SSEL)

## Notes on the sheet
- UEXT Ultrasonic Module
- UEXT Poteniomter Module
- UEXT MCU IR Bump Module | UEXT IR Bump Module
- UEXT GPS Module
- GPS CHIP
- UEXT CONNECTOR
- INDICATOR LIGHT
- UEXT Photoresistor Module
- UEXT IR Remote Module
- UEXT Bluetooth Module
- BLUETOOTH CHIP
- UEXT MCU IR Potentiometer Module
- UEXT MCU IR Photoresistor Module | UEXT CONNECTOR
- INDICATOR LIGHT

## Power pins joined to a net without a drawn wire
VBATT: U2.6(VBATT)

## Library data of the parts
C1-C10 = CAPACITORS:CAPACITORS: Capacitors ...4.7uF @ 6.3V -> 0402 ...10uF @ 16V -> 0603 ...22uF @ 25V -> 0805; AVAILABILITY: Unavailable; DESCRIPTION: 10pF ±5% 50V Ceramic Capacitor C0G, NP0 0201 _0603 Metric_; MF: Panasonic; MP: CAPACITORS; PACKAGE: 0201 Panasonic; PRICE: None
D1 D3 = led:SFH482: IR LED infrared emitting diode, Infineon
D2 D4 = opto-trans-siemens:BP104: PHOTO DIODE; MF: VISHAY/TELEFUNKEN; MPN: BP104; OC_FARNELL: 1779636; OC_NEWARK: 14M4504
IC1-IC3 = 74HC165PW_118:74HC165PW,118: 74HC(T)165 - 8-bit parallel-in/serial-out shift register@en-us Source: Datasheet <https://assets.nexperia.com/documents/data-sheet/74HC_HCT165.pdf>; DESCRIPTION: 74HC(T)165 - 8-bit parallel-in/serial-out shift register@en-us; HEIGHT: 1.1mm; MANUFACTURER_NAME: Nexperia; MANUFACTURER_PART_NUMBER: 74HC165PW,118; MOUSER_PART_NUMBER: 771-74HC165PW-T; MOUSER_PRICE-STOCK: https://www.mouser.com/Search/Refine.aspx?Keyword=771-74HC165PW-T
J1-J6 = FTSH-105-01-XXX-DV-K:FTSH-105-01-XXX-DV-K: 0.05"x0.05" DOUBLE ROW SMT STRIP ASSEMBLY. MANUFACTURER:SAMTEC.
LED1-LED7 = led:NFSG036BT: CHIP TYPE GREEN LED NFSx036xT Source: NICHIA CORPORATION .. NFSG036BT-E.pdf
LED8-LED10 = led:LSG-T676: LSG T676 Hyper Multi TOPLED ® Hyper-Bright LED Source: http://docs-europe.electrocomponents.com/webdocs/08c3/0900766b808c36ca.pdf
PH1 PH2 = photo-elements:VT2*: Photoconductive Cell VT200 Series Source: http://optoelectronics.perkinelmer.com/content/Datasheets/DTS_vt200seriesdatasheet.pdf
Q1 = NPN BJT:MMBT3904LP-7: MMBT3904LP Series 40 V 200 mA NPN Surface Mount Transistor - DFN1006-3; DESCRIPTION: Bipolar _BJT_ Transistor NPN 40V 200mA 300MHz 250mW Surface Mount 3-DFN1006 _1.0x0.6_; DIGI-KEY_PART_NUMBER: MMBT3904LP-7DICT-ND; DIGI-KEY_PURCHASE_URL: https://www.digikey.com/product-detail/en/diodes-incorporated/MMBT3904LP-7/MMBT3904LP-7DICT-ND/8283872?utm_source=snapeda&utm_medium=aggregator&utm_campaign=symbol; MF: Diodes Inc.; MP: MMBT3904LP-7; PACKAGE: DFN-3 Diodes Inc.
Q2 Q3 = MMBT3904LP-7:MMBT3904LP-7: MMBT3904LP Series 40 V 200 mA NPN Surface Mount Transistor - DFN1006-3; DESCRIPTION: Bipolar _BJT_ Transistor NPN 40V 200mA 300MHz 250mW Surface Mount 3-DFN1006 _1.0x0.6_; DIGI-KEY_PART_NUMBER: MMBT3904LP-7DICT-ND; DIGI-KEY_PURCHASE_URL: https://www.digikey.com/product-detail/en/diodes-incorporated/MMBT3904LP-7/MMBT3904LP-7DICT-ND/8283872?utm_source=snapeda&utm_medium=aggregator&utm_campaign=symbol; MF: Diodes Inc.; MP: MMBT3904LP-7; PACKAGE: DFN-3 Diodes Inc.
R1-R5 R8-R13 R15-R19 R21 R23-R42 R49-R51 R55 R56 R59-R61 = Resistor:ERJ-1RHD3601C: 0201 chip resistor 0201 SMD resistor 3600ohm 0.5%; AVAILABILITY: Unavailable; DESCRIPTION: 0201 chip resistor 0201 SMD resistor 3600ohm 0.5%; MF: Panasonic; MP: ERJ-1RHD3601C; PACKAGE: 0201 Panasonic; PRICE: None
R6 R7 R22 R43-R48 R52 R53 R57 R58 = rcl:R-EU_: RESISTOR, European symbol; SPICEPREFIX: R
R20 R54 = piher:PC16S(NOSILK): POTENTIOMETER single carbon potentiometer, 16 mm, S3ROH
S1-S3 S5-S7 = B3U-1000P:B3U-1000P: Switch Tactile N.O. SPST Round Button Gull Wing 0.05A 12VDC 1.5N SMD Embossed T/R; AVAILABILITY: Unavailable; DESCRIPTION: Tactile Switch SPST-NO Top Actuated Surface Mount; MF: Omron; MP: B3U-1000P; PACKAGE: None; PRICE: None
U1 = TSL260R-LF:TSL260R-LF: Ic Ir Light-Volt Conv Sidelooker; AVAILABILITY: Unavailable; DESCRIPTION: Optical Sensor IR 940nm Voltage Radial - 3 Leads; MF: ams; MP: TSL260R-LF; PACKAGE: Radial-3 ams; PRICE: None
U2 = TESEO-LIV3F:TESEO-LIV3F: Link: https://www.st.com/en/positioning/teseo-liv3f.html; AVAILABILITY: Unavailable; DESCRIPTION: - RF Receiver BeiDou, Galileo, GLONASS, GNSS, GPS 1.575GHz -163dBm 18-LCC _9.7x10.1_; MF: STMicroelectronics; MP: TESEO-LIV3F; PACKAGE: SMD-18 STMicroelectronics; PRICE: None
U3 = CYBLE-012011-00:CYBLE-012011-00: Bluetooth Bluetooth v4.1 Transceiver Module 2.4GHz ~ 2.48GHz Integrated, Trace Surface Mount; AVAILABILITY: Unavailable; DESCRIPTION: Bluetooth Bluetooth v4.1 Transceiver Module 2.4GHz ~ 2.48GHz Integrated, Trace Surface Mount; MF: Cypress Semiconductor; MP: CYBLE-012011-00; PACKAGE: Module Cypress Semiconductor; PRICE: None
U4 U7 U10 = SN74HC148D:SN74HC148D: 8:3 line Priority Encoder; AVAILABILITY: Unavailable; DESCRIPTION: IC 8-TO-3 PRIORITY ENCOD 16-SOIC; MF: Texas Instruments; MP: SN74HC148D; PACKAGE: SOIC-16 Texas Instruments; PRICE: None
U5 U6 U8 U9 U11 U12 = MAX964ESET:MAX964ESET; AVAILABILITY: Unavailable; DESCRIPTION: Linear IC - Comparator Maxim Integrated MAX964ESE+ Multi-purpose CMOS, TTL SOIC 16; MF: Maxim Integrated; MP: MAX964ESE+; PACKAGE: SOIC-16 Maxim; PRICE: None
U13 = HC-SR04:HC-SR04(NOSILK)
U$1-U$3 U$5 U$8-U$10 U$12 U$13 U$15 = UEXT-Connecotr:UEXT-SMD
U$4 U$6 U$7 U$11 U$14 = QFP50P900X900X160-48N:LPC11C24FBD48/301
VR1 VR2 = TrimmerPot:PVG3A200C01R00: Res Cermet Trimmer 20 Ohm 20% 1/4W 1(Elec)/1(Mech)Turn 2.2mm (3.6 X 3.6 X 2mm) J-Hook SMD T/R; AVAILABILITY: Unavailable; DESCRIPTION: 20 Ohms 0.25W, 1/4W J Lead Surface Mount Trimmer Potentiometer Cermet 1 Turn Top Adjustment; MF: Bourns; MP: PVG3A200C01R00; PACKAGE: TO-221 Bourns; PRICE: None